# Altium schematic sheet power.SchDoc
size A4; DocumentNumber: 5; SheetNumber: 5; SheetTotal: 24; SheetDescription: Decoupling and references for MCU0; ClassName: ISO_MCU
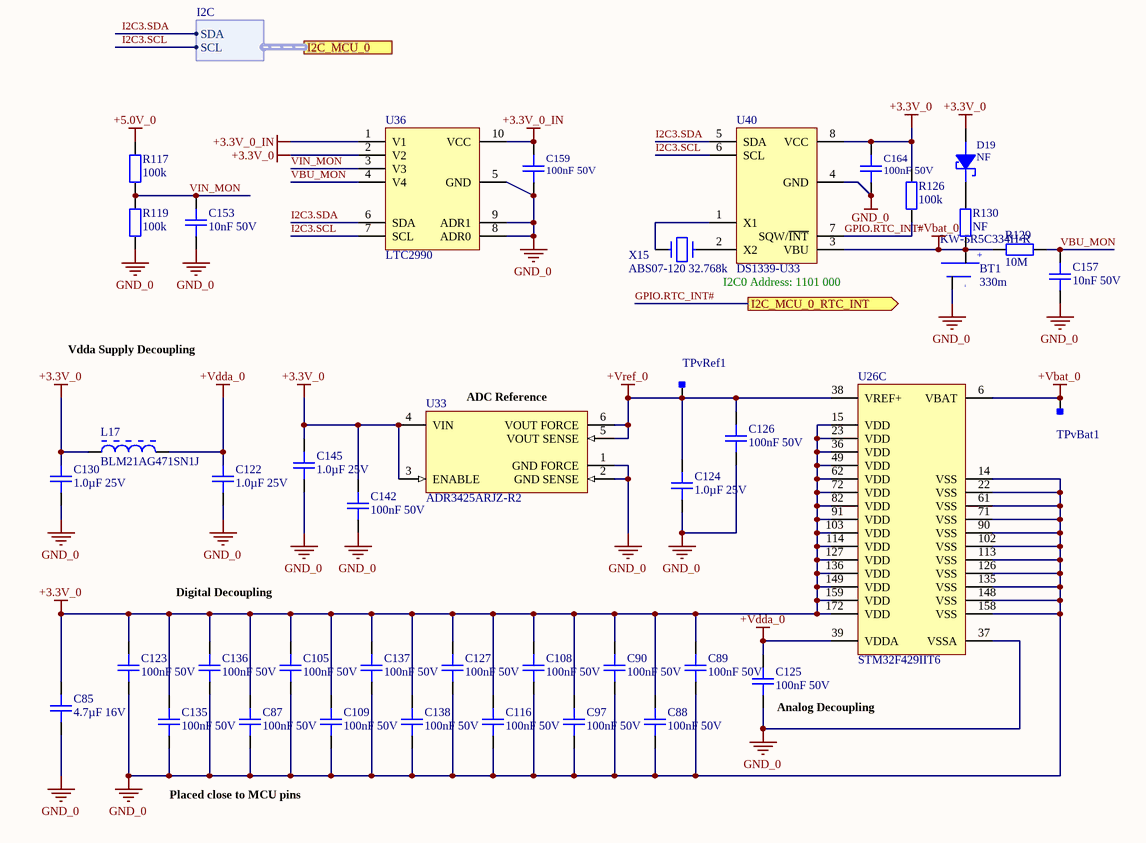
[diagram p0: power.SchDoc]

## Parts
BT1  330m  Supplier Part Number 1: KW-5R5C334H-R  [KW-5R5C]
C85  4.7µF 16V  [0805C]
C87  100nF 50V  [0402C]
C88  100nF 50V  [0402C]
C89  100nF 50V  [0402C]
C90  100nF 50V  [0402C]
C97  100nF 50V  [0402C]
C105  100nF 50V  [0402C]
C108  100nF 50V  [0402C]
C109  100nF 50V  [0402C]
C116  100nF 50V  [0402C]
C122  1.0µF 25V  [0603C]
C123  100nF 50V  [0402C]
C124  1.0µF 25V  [0603C]
C125  100nF 50V  [0402C]
C126  100nF 50V  [0402C]
C127  100nF 50V  [0402C]
C130  1.0µF 25V  [0603C]
C135  100nF 50V  [0402C]
C136  100nF 50V  [0402C]
C137  100nF 50V  [0402C]
C138  100nF 50V  [0402C]
C142  100nF 50V  [0603C]
C145  1.0µF 25V  [0603C]
C153  10nF 50V  [0603C]
C157  10nF 50V  [0603C]
C159  100nF 50V  [0603C]
C164  100nF 50V  [0603C]
D19  NF  [NF_SOD-523]
L17  BLM21AG471SN1J  [MURA-BLM21-H1-CHIP-2_V]
R117  100k  [0603R]
R119  100k  [0603R]
R126  100k  [0603R]
R129  10M  [0603R]
R130  NF  [0603R]
TPvBat1  Testpoint_Square  [Testpoint_S1]  (value not drawn)  (no BOM)
TPvRef1  Testpoint_Square  [Testpoint_S1]  (value not drawn)  (no BOM)
U26  STM32F429IIT6  [STM-LQFP176_N]  (part C of 3)
U33  ADR3425ARJZ-R2  [ADI-RJ-6_N]
U36  LTC2990  [MSOP-10]
U40  DS1339-U33  [USOP-8]
X15  ABS07-120 32.768k  [ABS07]

## Ports
I2C_MCU_0 (harness I2C), I2C_MCU_0_RTC_INT (out)

## Harnesses
I2C: SDA, SCL

## Nets
+3.3V_0: C85.1 C87.1 C88.1 C89.1 C90.1 C97.1 C105.1 C108.1 C109.1 C116.1 C123.1 C127.1 C130.1 C135.1 C136.1 C137.1 C138.1 C142.1 C145.1 C164.1 D19.1(A) L17.1 R126.2 U26.15(VDD) U26.23(VDD) U26.36(VDD) U26.49(VDD) U26.62(VDD) U26.72(VDD) U26.82(VDD) U26.91(VDD) U26.103(VDD) U26.114(VDD) U26.127(VDD) U26.136(VDD) U26.149(VDD) U26.159(VDD) U26.172(VDD) U33.3(ENABLE) U33.4(VIN) U36.2(V2) U40.8(VCC)
+3.3V_0_IN: C159.1 U36.1(V1) U36.10(VCC)
+5.0V_0: R117.2
+Vbat_0: BT1.1(pos1) R129.2 R130.2 TPvBat1.1 U26.6(VBAT) U40.3(VBU)
+Vdda_0: C122.1 C125.1 L17.2 U26.39(VDDA)
+Vref_0: C124.1 C126.1 TPvRef1.1 U26.38(VREF+) U33.5(VOUT_SENSE) U33.6(VOUT_FORCE)
GND_0: BT1.2(neg) C85.2 C87.2 C88.2 C89.2 C90.2 C97.2 C105.2 C108.2 C109.2 C116.2 C122.2 C123.2 C124.2 C125.2 C126.2 C127.2 C130.2 C135.2 C136.2 C137.2 C138.2 C142.2 C145.2 C153.1 C157.1 C159.2 C164.2 R119.1 U26.14(VSS) U26.22(VSS) U26.37(VSSA) U26.61(VSS) U26.71(VSS) U26.90(VSS) U26.102(VSS) U26.113(VSS) U26.126(VSS) U26.135(VSS) U26.148(VSS) U26.158(VSS) U33.1(GND_FORCE) U33.2(GND_SENSE) U36.5(GND) U36.8(ADR0) U36.9(ADR1) U40.4(GND)
GPIO.RTC_INT#: R126.1 U40.7(SQW/~{INT}) ; port I2C_MCU_0_RTC_INT
I2C3.SCL: U36.7(SCL) U40.6(SCL) ; port I2C_MCU_0.SCL
I2C3.SDA: U36.6(SDA) U40.5(SDA) ; port I2C_MCU_0.SDA
VBU_MON: C157.2 R129.1 U36.4(V4)
VIN_MON: C153.2 R117.1 R119.2 U36.3(V3)
NetD19_2: D19.2(C) R130.1
NetU40_1: U40.1(X1) X15.2
NetU40_2: U40.2(X2) X15.1

## Notes on the sheet
- I2C0 Address: 1101 000
- Vdda Supply Decoupling
- (near U33) ADC Reference
- Digital Decoupling
- (near C125) Analog Decoupling
- Placed close to MCU pins
- Title
- Size:
- Date:
- Tabloid
- Number:
- Time:
- Revision:
- Sheet
- of
- File:
- (in symbol BATTERY_1) +; -

## Library data of the parts
BT1 = BATTERY_1: Eaton 330mF, 5.5v, -20 to +80, Ultracapacitor, KW-5R5C334H-R; Manufacturer 1: Eaton - Electronics Division; DBDesc: 330m 5.5V super capacitor -40-+85degC 13.5mm 8.5mm tall, RoHS compliant (DUPLICATE OF ID#22645); ID: 27713; Capacitance: 330mF; Manufacturer Part Number 1: KW-5R5C334H-R; Supplier 1: Avnet; Stock 1: 0; Pricing 1: 400=2.49000, 800=2.39000, 1600=2.29000, 2400=2.29000, 4000=2.19000 (USD); RoHS: No
C85 = gen_C_ceramic_4u7_16V_X7R_0805: Ceramic, 4.7µF, ±10%, 16V, X7R, –55 to 125°C, 0805 (2012),RoHS, Automotive; Part Number: GCJ21BR71C475KA01; Manufacturer: Murata; Capacitance: 4u7; Case EIA: 0805; Case Metric: 2012; AVT Set: x; Automotive Qualified: True; PnP Package: C_0805_10; PnP Value: 4.7µF/16V/X7R; Rated Voltage: 16V; Dielectric: X7R; Supplier 1: Digi-Key; Supplier Part Number 1: 490-10557-1-ND; Height - Seated (Max): 1.25mm; Mounting Type: SurfaceMount,MLCC; Operating Temperature: –55 to 125°C; Series: GCJ; Tolerance: ±10%; Manufacturer_Part_Number: GCJ21BR71C475KA01
C87-C90 C97 C105 C108 C109 C116 C123 C125-C127 C135-C138 = gen_C_ceramic_100n_50V_X7R_0402: Ceramic, 100nF, ±10%, 50V, X7R, –55 to 125°C, 0402 (1005),RoHS, Automotive; Part Number: GCM155R71H104KE02; Manufacturer: Murata; Capacitance: 100n; Case EIA: 0402; Case Metric: 1005; PnP Package: C_0402_10; PnP Value: 100nF/50V/X7R; Automotive Qualified: True; PnP equipped: x; Rated Voltage: 50V; Dielectric: X7R; Supplier 1: Digi-Key; Supplier Part Number 1: 490-10672-1-ND; Height - Seated (Max): 0.5mm; Mounting Type: SurfaceMount,MLCC; Operating Temperature: –55 to 125°C; Series: GCM; Tolerance: ±10%; Manufacturer_Part_Number: GCM155R71H104KE02
C122 C124 C130 C145 = gen_C_ceramic_1u_25V_X7R_0603: Ceramic, 1.0µF, ±10%, 25V, X7R, –55 to 125°C, 0603 (1608),RoHS, Automotive; Part Number: GCJ188R71E105KA01; Manufacturer: Murata; Capacitance: 1µF; Case EIA: 0603; Case Metric: 1608; PnP Package: C_0603_10; PnP Value: 1.0µF/25V/X7R; Automotive Qualified: True; Rated Voltage: 25V; Dielectric: X7R; Supplier 1: Digi-Key; Supplier Part Number 1: 490-14409-1-ND; Height - Seated (Max): 0.8mm; Mounting Type: SurfaceMount,MLCC; Operating Temperature: –55 to 125°C; Series: GCJ; Tolerance: ±10%; Manufacturer_Part_Number: GCJ188R71E105KA01
C142 = gen_C_ceramic_100n_50V_X7R_0603: Ceramic, 100nF, ±10%, 50V, X7R, –55 to 125°C, 0603 (1608),RoHS, Automotive; Part Number: GCJ188R71H104KA12; Manufacturer: Murata; Capacitance: 100n; Case EIA: 0603; Case Metric: 1608; PnP Package: C_0603_10; PnP Value: 100nF/50V/X7R; PnP equipped: x; Automotive Qualified: True; Rated Voltage: 50V; Dielectric: X7R; Supplier 1: Digi-Key; Supplier Part Number 1: 490-5798-1-ND; Height - Seated (Max): 0.8mm; Mounting Type: SurfaceMount,MLCC; Operating Temperature: –55 to 125°C; Series: GCJ; Tolerance: ±10%; Manufacturer_Part_Number: GCJ188R71H104KA12
C153 C157 = gen_C_ceramic_10n_50V_X7R_0603: Ceramic, 10nF, ±10%, 50V, X7R, –55 to 125°C, 0603 (1608),RoHS, Automotive; Part Number: GCJ188R71H102KA01; Manufacturer: Murata; Case EIA: 0603; Case Metric: 1608; Capacitance: 10n; Automotive Qualified: True; PnP Package: C_0603_10; PnP Value: 10nF/50V/X7R; Dielectric: X7R; Rated Voltage: 50V; Height - Seated (Max): 0.8mm; Mounting Type: SurfaceMount,MLCC; Operating Temperature: –55 to 125°C; Series: GCJ; Tolerance: ±10%; Manufacturer_Part_Number: GCJ188R71H102KA01; Supplier 1: Digi-Key; Supplier Part Number 1: 490-5768-1-ND
C159 C164 = gen_C_ceramic_100n_50V_X7R_0603: Ceramic, 100nF, ±10%, 50V, X7R, –55 to 125°C, 0603 (1608),RoHS, Automotive; Part Number: GCJ188R71H104KA12; Manufacturer: Murata; Capacitance: 100n; Case EIA: 0603; Case Metric: 1608; Automotive Qualified: True; PnP Package: C_0603_10; PnP Value: 100nF/50V/X7R; Dielectric: X7R; Rated Voltage: 50V; Height - Seated (Max): 0.8mm; Mounting Type: SurfaceMount,MLCC; Operating Temperature: –55 to 125°C; Series: GCJ; Tolerance: ±10%; Manufacturer_Part_Number: GCJ188R71H104KA12; Supplier 1: Digi-Key; Supplier Part Number 1: 490-5798-1-ND
D19 = DIODE_SCHTKY: BAT41 Schottky diode, small signal,SOD-523 package, RoHS compliant; DBDesc: do not populate, RoHS compliant; ID: 908; Preffered ID: 20995
L17 = CMP-0686-00649-2: Chip Ferrite Bead for General Signal lines, 470 Ohm, 700 mA, -55 to 125 degC, 2 x 1.25 x 1.05 mm SMD, Tape and Reel; Manufacturer: Murata; DC Resistance: 0.19 Ohm Max.; Impedance (at 100 MHz): 470 Ohm +/- 25%; Rated Current: 700 mA; ComponentLink1URL: http://www.murata.com/; Packing: Tape and Reel; PackageDescription: 2-Pin Chip, Body 2 x 1.25 mm; ComponentLink3Description: Package Specification; Operating Temperature Range: -55 to 125 degC; ComponentLink1Description: Manufacturer URL; PartNumber: BLM21AG471SN1J; DatasheetVersion: 08/2013; Mounting Technology: Surface Mount; ComponentLink2URL: http://www.murata.com/products/catalog/pdf/c31e.pdf; ComponentLink3URL: http://www.murata.com/products/catalog/pdf/c31e.pdf; ComponentLink2Description: Datasheet; PackageReference: BLM21_H1050-2; Part Number: BLM21AG471SN1J
R117 R119 R126 = gen_R_100k_0603: SMD Resistor 100k 0603; Case EIA: 0603; Case Metric: 1608; PnP Package: R_0603; Automotive Qualified: False; Operating Temperature: -55°C - +155°C; PnP Value: 100k; Part Number: gen_R_100k_0603
R129 = gen_R_10M_0603: SMD Resistor 10M 0603; Part Number: gen_R_10Meg_0603; Case EIA: 0603; Case Metric: 1608; PnP Package: R_0603; PnP Value: 10Meg; Automotive Qualified: False; Operating Temperature: -55°C - +155°C
R130 = gen_R_NF_0603: SMD Resistor NF 0603; Case EIA: 0603; Case Metric: 1608; PnP Package: R_0603; Automotive Qualified: False; Operating Temperature: -55°C - +155°C; Part Number: gen_R_NF_0603; PnP Value: NF
TPvBat1 TPvRef1 = Testpoint_Square: Testpoint, square; Part Number: Testpoint_Square
U26 = MC-ARM-STM32F4X9-SQ176: ARM Cortex-M4 32-bit MCU+FPU, 225 DMIPS, 2048 kB Flash, 256 kB Internal RAM, 140 I/Os, 176-pin LQFP, -40 to 85 degC, Tray; Manufacturer: STMicroelectronics; Internal RAM Size (kB): 256; I/Os (High Current): 140; FLASH Size (Prog) (kB): 2048; D/A Converter: 2x12-bit; Supply Voltage(Vcc) max (V): 3.6; Operating Frequency(F) (Processor speed) (MHz): 180; Supply Voltage(Vcc) min (V): 1.8; Core: ARM Cortex-M4; PackageReference: LQFP176; ComponentLink1Description: Manufacturer URL; Packing: Tray; ComponentLink2Description: Datasheet; ComponentLink3Description: Package Specification; ComponentLink2URL: http://www.st.com/st-web-ui/static/active/en/resource/technical/document/data_brief/DM00053488.pdf; PackageVersion: Rev. 4, 06/2013; ComponentLink1URL: http://www.st.com/web/en/home.html; DatasheetVersion: Rev. 2; PartNumber: STM32F429IIT6; PackageDescription: 176-Pin Low Profile Quad Flat Package, 24 x 24 mm Body, 0.5 mm Pitch; ComponentLink3URL: http://www.st.com/st-web-ui/static/active/en/resource/technical/document/datasheet/DM00035129.pdf; Mounting Technology: Surface Mount; Part Number: STM32F429IIT6
U33 = CMP-0784-00366-1: Micropower, High Accuracy Voltage Reference, 2.5 V Output, 2.7 to 5.5 V Supply, Industrial, 6-pin SOT23 (RJ-6), Reel; Manufacturer: Analog Devices; Vout: 2.5V; Ref Out TC (ppm/C): 2.5; Min V Supply (V): 2.7; Max V Supply (V): 5.5; ComponentLink3URL: http://www.analog.com/static/imported-files/packages/PKG_PDF/SOT-23(RJ)/RJ_6.pdf; Mounting Technology: Surface Mount; Packing: Reel; ComponentLink3Description: Package Specification; Code_JEDEC: MO-178-AB; PackageReference: RJ-6; Operating Temp Range: -40 to 125 degC; PartNumber: ADR3425ARJZ-R2; ComponentLink2Description: Datasheet; PackageDescription: 6-Pin Small Outline Transistor Package, Body 2.9 x 1.6 mm, Pitch 0.95 mm; ComponentLink1URL: http://www.analog.com/en/index.html; ComponentLink2URL: http://www.analog.com/static/imported-files/data_sheets/ADR3412_ADR3420_ADR3425_ADR3430_ADR3433_ADR3440_ADR3450.pdf; ComponentLink1Description: Manufacturer URL; PackageVersion: 121608-A, 12/2008; ComponentLink4URL: Product URL:http://www.analog.com/en/special-linear-functions/voltage-references/adr3425/products/product.html; ComponentLink4Description: URL Link1; DatasheetVersion: Rev. B; Part Number: ADR3425ARJZ-R2
U36 = LTC2990: ID: 19355; DBDesc: Linear LTC2990IMS quad I2C voltage, current and temperature monitor, -40°C to +85°C, 10-pin MSOP, RoHS compliant; Part Number: LTC2990
U40 = DS1339-U33: DBDesc: DS1339U-33+ RTC I2C w/alarm USOP-8, RoHS compliant; ID: 11376; Part Number: DS1339-U33
X15 = CRYSTAL1: ID: 22914; DBDesc: 32.768kHz ABS07-120, 20ppm, 6pF load, 60k ESR, 3.2x1.5mm crystal, RoHS compliant